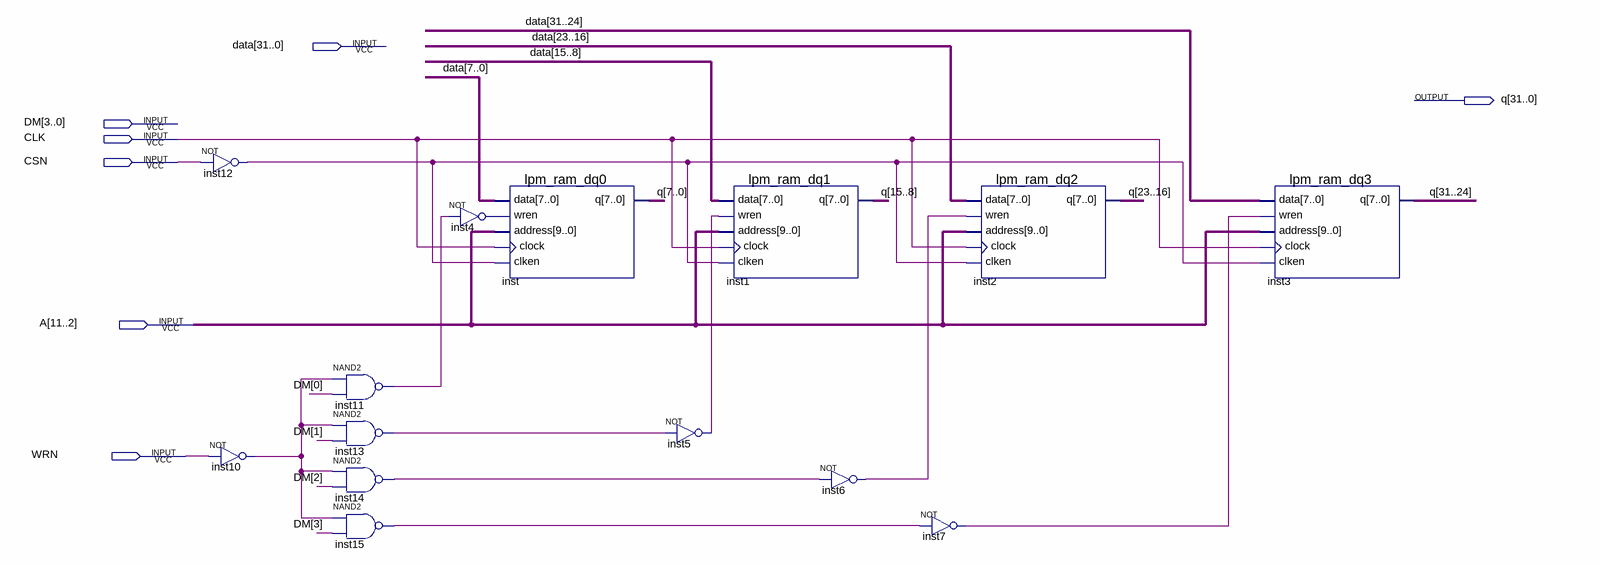
[diagram p0: schematic sheet]
// Quartus schematic DMEM.bdf as structural Verilog: 14 symbols, 7 pins
module DMEM (
  input  [31:0] data,
  input  [3:0] DM,
  input  CLK,
  input  CSN,
  input  [11:2] A,
  input  WRN,
  output [31:0] q
);

  wire inst4_out, inst5_out, inst6_out, inst7_out, inst10_out, inst11_out, inst12_out, inst13_out,
       inst14_out, inst15_out;

  not inst12 (inst12_out, CSN);
  not inst10 (inst10_out, WRN);
  nand inst11 (inst11_out, inst10_out, DM[0]);
  nand inst13 (inst13_out, inst10_out, DM[1]);
  nand inst14 (inst14_out, inst10_out, DM[2]);
  nand inst15 (inst15_out, inst10_out, DM[3]);
  not inst4 (inst4_out, inst11_out);
  lpm_ram_dq0 inst (.data(data[7:0]), .wren(inst4_out), .address(A), .clock(CLK), .clken(inst12_out), .q(q[7:0]));
  not inst5 (inst5_out, inst13_out);
  lpm_ram_dq1 inst1 (.data(data[15:8]), .wren(inst5_out), .address(A), .clock(CLK), .clken(inst12_out), .q(q[15:8]));
  not inst6 (inst6_out, inst14_out);
  lpm_ram_dq2 inst2 (.data(data[23:16]), .wren(inst6_out), .address(A), .clock(CLK), .clken(inst12_out), .q(q[23:16]));
  not inst7 (inst7_out, inst15_out);
  lpm_ram_dq3 inst3 (.data(data[31:24]), .wren(inst7_out), .address(A), .clock(CLK), .clken(inst12_out), .q(q[31:24]));
endmodule
